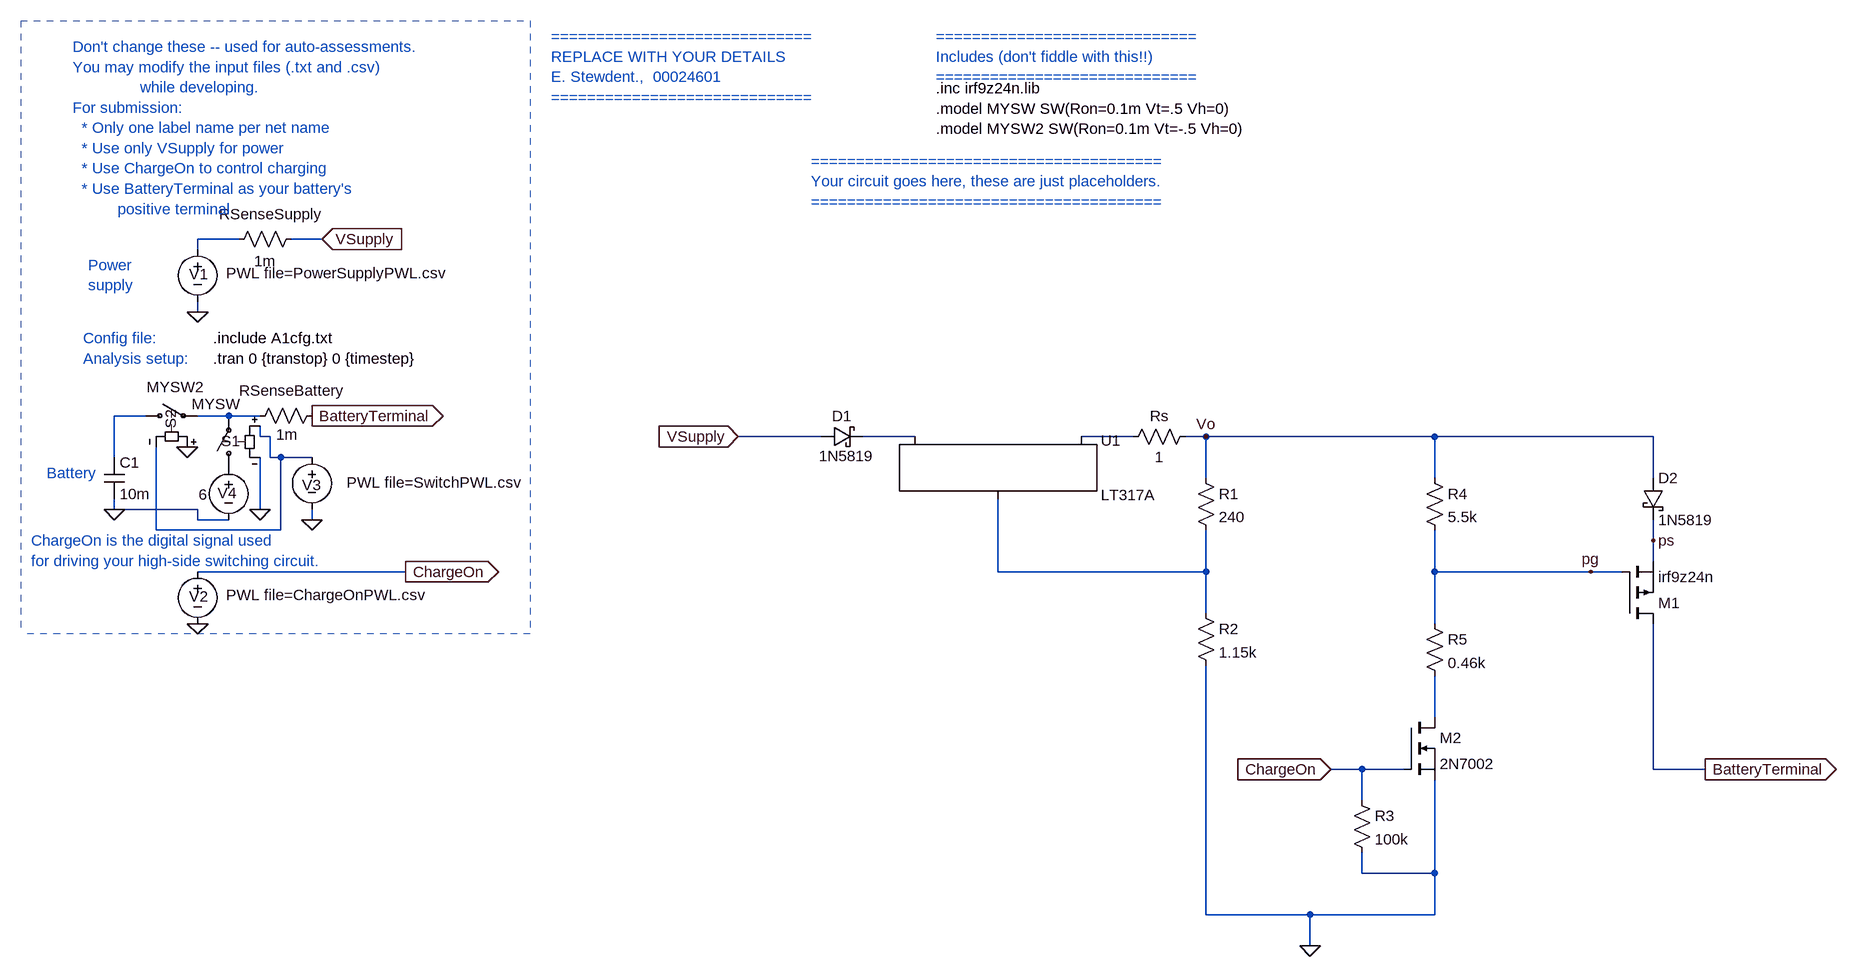
[diagram p0: schematic E344_22603263_A1.asc]
E344_22603263_A1.asc, the LTspice schematic file:
Version 4
SHEET 1 1824 680
WIRE -2032 -1088 -2096 -1088
WIRE -1904 -1088 -1952 -1088
WIRE -2096 -1072 -2096 -1088
WIRE -2096 -976 -2096 -992
WIRE -2176 -816 -2224 -816
WIRE -2048 -816 -2096 -816
WIRE -2000 -816 -2048 -816
WIRE -2000 -784 -2000 -800
WIRE -1984 -784 -2000 -784
WIRE -1136 -784 -1264 -784
WIRE -992 -784 -1072 -784
WIRE -656 -784 -736 -784
WIRE -544 -784 -576 -784
WIRE -192 -784 -544 -784
WIRE 144 -784 -192 -784
WIRE -2224 -752 -2224 -816
WIRE -1984 -752 -1984 -784
WIRE -1968 -752 -1984 -752
WIRE -1920 -752 -1968 -752
WIRE -544 -720 -544 -784
WIRE -192 -720 -192 -784
WIRE 144 -720 144 -784
WIRE -2224 -672 -2224 -688
WIRE -2096 -672 -2224 -672
WIRE -2000 -672 -2000 -752
WIRE -2096 -656 -2096 -672
WIRE -2048 -656 -2096 -656
WIRE -1920 -656 -1920 -672
WIRE -2160 -640 -2160 -768
WIRE -1968 -640 -1968 -752
WIRE -1968 -640 -2160 -640
WIRE 144 -624 144 -656
WIRE 144 -592 144 -624
WIRE -1776 -576 -2096 -576
WIRE -864 -576 -864 -688
WIRE -544 -576 -544 -640
WIRE -544 -576 -864 -576
WIRE -192 -576 -192 -640
WIRE 48 -576 -192 -576
WIRE 96 -576 48 -576
WIRE -544 -512 -544 -576
WIRE -192 -496 -192 -576
WIRE -192 -352 -192 -416
WIRE -304 -272 -352 -272
WIRE -240 -272 -304 -272
WIRE 144 -272 144 -496
WIRE 224 -272 144 -272
WIRE -304 -224 -304 -272
WIRE -304 -112 -304 -144
WIRE -192 -112 -192 -256
WIRE -192 -112 -304 -112
WIRE -544 -48 -544 -432
WIRE -384 -48 -544 -48
WIRE -192 -48 -192 -112
WIRE -192 -48 -384 -48
WIRE -384 0 -384 -48
FLAG -2096 -976 0
FLAG -1904 -1088 VSupply
IOPIN -1904 -1088 In
FLAG -1920 -816 BatteryTerminal
IOPIN -1920 -816 Out
FLAG -1776 -576 ChargeOn
IOPIN -1776 -576 Out
FLAG -2096 -496 0
FLAG -1264 -784 VSupply
IOPIN -1264 -784 In
FLAG 224 -272 BatteryTerminal
IOPIN 224 -272 Out
FLAG -352 -272 ChargeOn
IOPIN -352 -272 In
FLAG -2000 -672 0
FLAG -1920 -656 0
FLAG -2112 -768 0
FLAG -2224 -672 0
FLAG -384 0 0
FLAG 48 -576 pg
FLAG 144 -624 ps
FLAG -544 -784 Vo
SYMBOL voltage -2096 -1088 R0
WINDOW 123 0 0 Left 0
WINDOW 39 0 0 Left 0
WINDOW 3 44 52 Left 2
WINDOW 0 -13 54 Left 2
SYMATTR Value PWL file=PowerSupplyPWL.csv
SYMATTR InstName V1
SYMBOL res -1904 -832 R90
WINDOW 0 -7 47 VBottom 2
WINDOW 3 29 54 VTop 2
SYMATTR InstName RSenseBattery
SYMATTR Value 1m
SYMBOL res -1936 -1104 R90
WINDOW 0 -7 47 VBottom 2
WINDOW 3 34 56 VTop 2
SYMATTR InstName RSenseSupply
SYMATTR Value 1m
SYMBOL cap -2240 -752 R0
SYMATTR InstName C1
SYMATTR Value 10m
SYMATTR SpiceLine2 IC=6
SYMBOL voltage -2096 -592 R0
WINDOW 123 0 0 Left 0
WINDOW 39 0 0 Left 0
WINDOW 3 44 52 Left 2
WINDOW 0 -13 54 Left 2
SYMATTR Value PWL file=ChargeOnPWL.csv
SYMATTR InstName V2
SYMBOL PowerProducts\\LT317A -864 -784 R0
SYMATTR InstName U1
SYMBOL pmos 96 -496 M180
SYMATTR InstName M1
SYMATTR Value irf9z24n
SYMATTR Prefix X
SYMATTR SpiceModel irf9z24n
SYMBOL nmos -240 -352 R0
SYMATTR InstName M2
SYMATTR Value 2N7002
SYMBOL schottky -1136 -768 R270
WINDOW 0 32 32 VTop 2
WINDOW 3 2 39 VBottom 2
SYMATTR InstName D1
SYMATTR Value 1N5819
SYMATTR Description Diode
SYMATTR Type diode
SYMBOL schottky 128 -720 R0
SYMATTR InstName D2
SYMATTR Value 1N5819
SYMATTR Description Diode
SYMATTR Type diode
SYMBOL sw -2048 -720 R180
WINDOW 0 -18 57 Left 2
WINDOW 3 -17 114 Left 2
SYMATTR InstName S1
SYMATTR Value MYSW
SYMBOL voltage -1920 -768 R0
WINDOW 0 0 43 Top 2
WINDOW 3 188 70 Bottom 2
WINDOW 123 0 0 Left 0
WINDOW 39 0 0 Left 0
SYMATTR InstName V3
SYMATTR Value PWL file=SwitchPWL.csv
SYMBOL sw -2192 -816 R270
WINDOW 0 -20 55 Left 2
WINDOW 3 44 18 VRight 2
SYMATTR InstName S2
SYMATTR Value MYSW2
SYMBOL voltage -2048 -752 R0
WINDOW 0 -17 55 Left 2
WINDOW 3 -46 57 Left 2
WINDOW 123 0 0 Left 0
WINDOW 39 0 0 Left 0
SYMATTR InstName V4
SYMATTR Value 6
SYMBOL res -672 -768 R270
WINDOW 0 32 56 VTop 2
WINDOW 3 0 56 VBottom 2
SYMATTR InstName Rs
SYMATTR Value 1
SYMBOL res -560 -736 R0
SYMATTR InstName R1
SYMATTR Value 240
SYMBOL res -560 -528 R0
SYMATTR InstName R2
SYMATTR Value 1.15k
SYMBOL res -320 -240 R0
SYMATTR InstName R3
SYMATTR Value 100k
SYMBOL res -208 -736 R0
SYMATTR InstName R4
SYMATTR Value 5.5k
SYMBOL res -208 -512 R0
SYMATTR InstName R5
SYMATTR Value 0.46k
TEXT -2072 -904 Left 2 !.tran 0 {transtop} 0 {timestep}
TEXT -2072 -936 Left 2 !.include A1cfg.txt
TEXT -2288 -1384 Left 2 ;Don't change these -- used for auto-assessments.\nYou may modify the input files (.txt and .csv) \n               while developing.\nFor submission: \n  * Only one label name per net name\n  * Use only VSupply for power\n  * Use ChargeOn to control charging\n  * Use BatteryTerminal as your battery's \n          positive terminal
TEXT -2272 -936 Left 2 ;Config file:
TEXT -2272 -904 Left 2 ;Analysis setup:
TEXT -2328 -728 Left 2 ;Battery
TEXT -2264 -1048 Left 2 ;Power\nsupply
TEXT -1552 -1400 Left 2 ;=============================\nREPLACE WITH YOUR DETAILS\nE. Stewdent.,  00024601\n=============================
TEXT -960 -1320 Left 2 !.inc irf9z24n.lib\n.model MYSW SW(Ron=0.1m Vt=.5 Vh=0)\n.model MYSW2 SW(Ron=0.1m Vt=-.5 Vh=0)
TEXT -2352 -624 Left 2 ;ChargeOn is the digital signal used \nfor driving your high-side switching circuit.
TEXT -960 -1400 Left 2 ;=============================\nIncludes (don't fiddle with this!!)\n=============================
TEXT -1152 -1208 Left 2 ;=======================================\nYour circuit goes here, these are just placeholders.\n=======================================
LINE Normal -1584 -1424 -1584 -480 2
LINE Normal -2368 -1424 -1584 -1424 2
LINE Normal -1584 -480 -2368 -480 2
LINE Normal -1584 -496 -1584 -496 2
LINE Normal -2368 -1424 -2368 -480 2

The netlist it stands for:
* E344_22603263_A1.asc
V1 N001 0 PWL file=PowerSupplyPWL.csv
RSenseBattery BatteryTerminal N003 1m
RSenseSupply VSupply N001 1m
C1 N002 0 10m IC=6
V2 ChargeOn 0 PWL file=ChargeOnPWL.csv
XU1 N007 N006 N005 LT317A
XM1 BatteryTerminal pg ps irf9z24n irf9z24n  ; pins D G S
M2 N008 ChargeOn 0 0 2N7002
D1 VSupply N005 1N5819
D2 Vo ps 1N5819
S1 P001 N003 N004 0 MYSW
V3 N004 0 PWL file=SwitchPWL.csv
S2 N002 N003 0 N004 MYSW2
V4 P001 0 6
Rs N006 Vo 1
R1 Vo N007 240
R2 N007 0 1.15k
R3 ChargeOn 0 100k
R4 Vo pg 5.5k
R5 pg N008 0.46k
.model D D
.lib standard.dio
.model NMOS NMOS
.model PMOS PMOS
.lib standard.mos
.tran 0 {transtop} 0 {timestep}
.include A1cfg.txt
* Don't change these -- used for auto-assessments.
* You may modify the input files (.txt and .csv)
*                while developing.
* For submission:
*   * Only one label name per net name
*   * Use only VSupply for power
*   * Use ChargeOn to control charging
*   * Use BatteryTerminal as your battery's
*           positive terminal
* Config file:
* Analysis setup:
* Battery
* Power
* supply
* =============================
* REPLACE WITH YOUR DETAILS
* E. Stewdent.,  00024601
* =============================
.inc irf9z24n.lib
.model MYSW SW(Ron=0.1m Vt=.5 Vh=0)
.model MYSW2 SW(Ron=0.1m Vt=-.5 Vh=0)
* ChargeOn is the digital signal used
* for driving your high-side switching circuit.
* =============================
* Includes (don't fiddle with this!!)
* =============================
* =======================================
* Your circuit goes here, these are just placeholders.
* =======================================
.lib LTC.lib
.backanno
.end

* Results of the author's LTspice run, read from the files saved beside the schematic
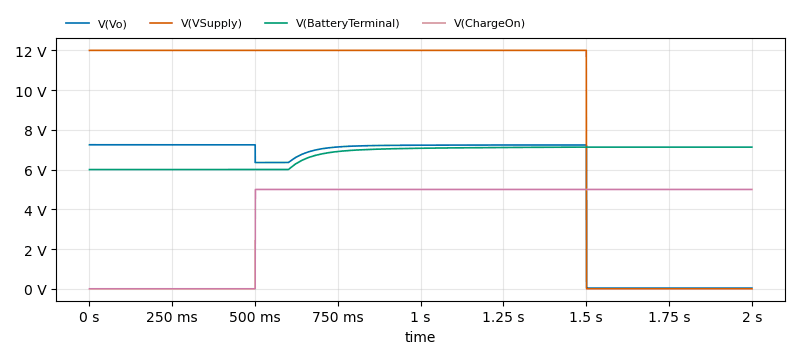
[diagram p1: Transient Analysis of E344_22603263_A1.asc, plotted from the saved traces]
* Transient Analysis, 1 run:
*   V(Vo): min 35.44 mV, max 7.249 V, average 5.367 V, rms 6.189 V, last 35.73 mV
*   V(VSupply): min 0 V, max 12 V, average 9.003 V, rms 10.39 V, last 0 V
*   V(BatteryTerminal): min 6 V, max 7.132 V, average 6.733 V, rms 6.751 V, last 7.13 V
*   V(ChargeOn): min 0 V, max 5 V, average 3.749 V, rms 4.329 V, last 5 V